# Altium schematic sheet connections.schdoc
size 209 x 297 mm; Scale: 1:1; DocumentType: Схема электрическая принципиальная; FirstReferrence: АБВГ.123456.001; PageSetup: Record=PageOptions|CenterHorizontal=False|CenterVertical=False|PrintScale=0.95|XCorrection=0.00|YCorrection=0.00|PrintKind=1|BorderSize=5000000|LeftOffset=0|BottomOffset=0|Orientation=1|PaperLength=1000|PaperWidth=1000|Scale=100|PaperSource=15|PrintQuality=600|MediaType=1|DitherType=10|PaperKind=A4|PrintScaleMode=1
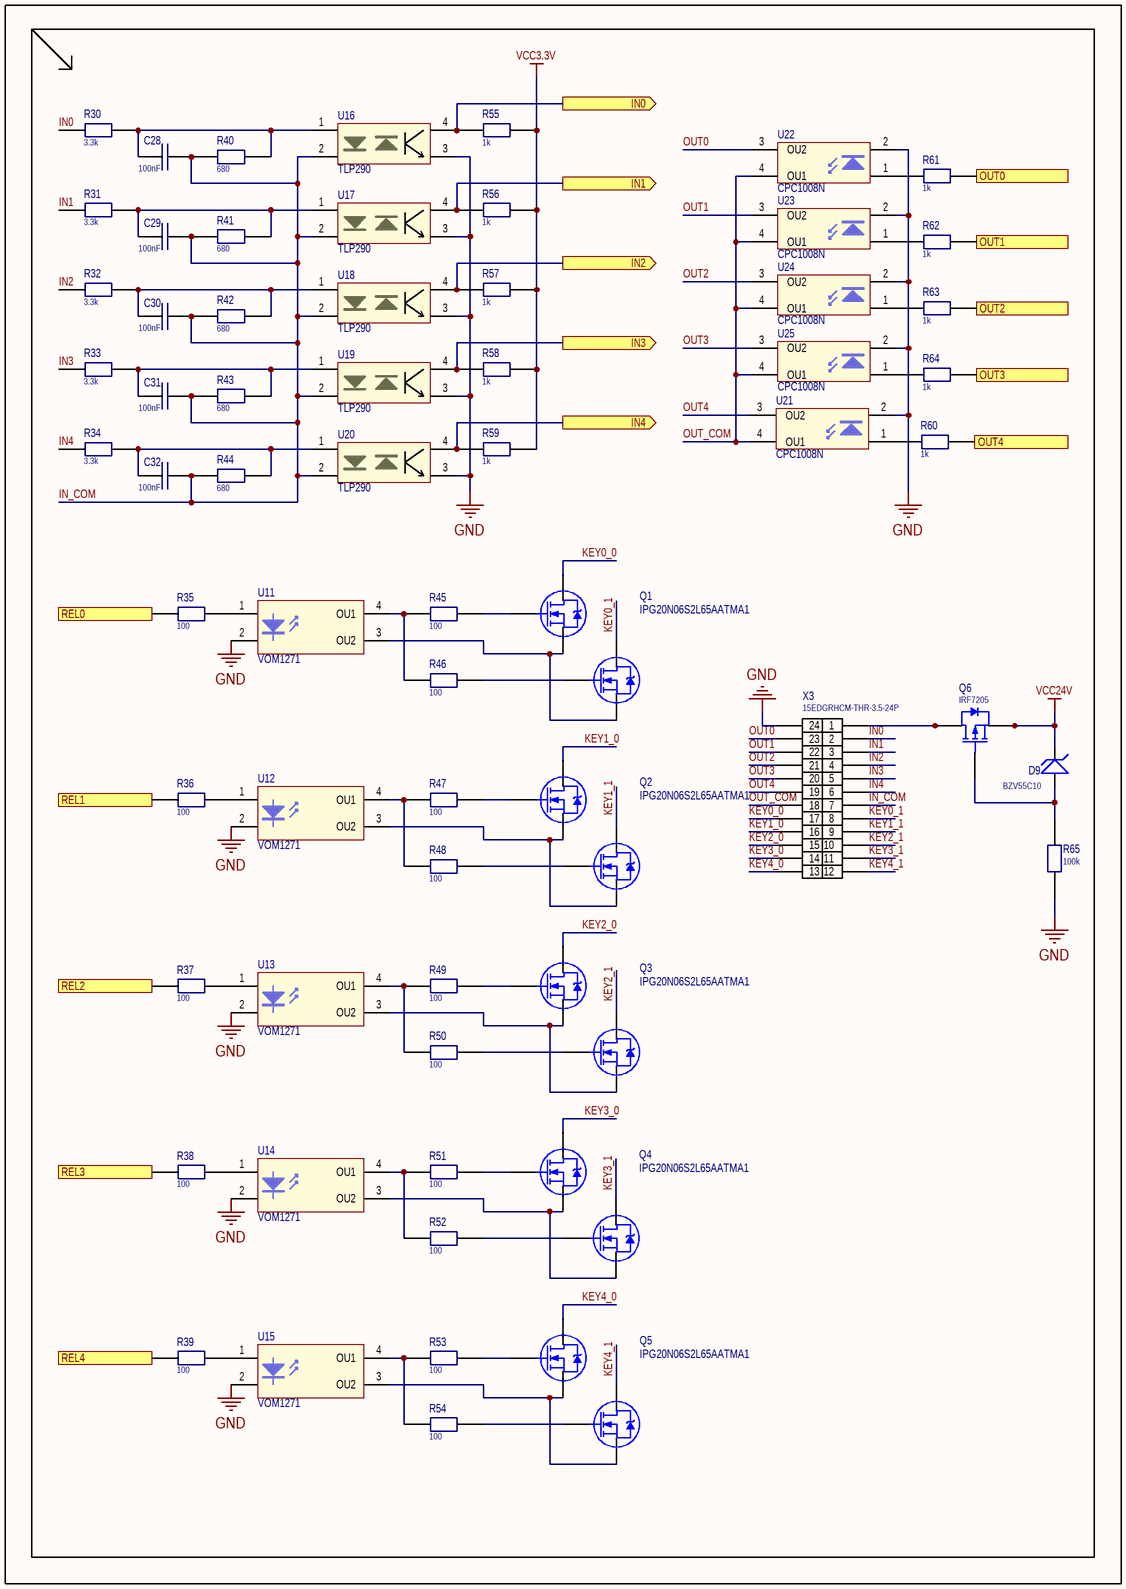
[diagram p0: connections.schdoc]

## Parts
C28  100nF  [C_0603]
C29  100nF  [C_0603]
C30  100nF  [C_0603]
C31  100nF  [C_0603]
C32  100nF  [C_0603]
D9  BZV55C10  [SOD80C]
Q1  IPG20N06S2L65AATMA1  [PowerFlat 5x6]
Q2  IPG20N06S2L65AATMA1  [PowerFlat 5x6]
Q3  IPG20N06S2L65AATMA1  [PowerFlat 5x6]
Q4  IPG20N06S2L65AATMA1  [PowerFlat 5x6]
Q5  IPG20N06S2L65AATMA1  [PowerFlat 5x6]
Q6  IRF7205  [SO-8_M]
R30  3.3k  [R_0805]
R31  3.3k  [R_0805]
R32  3.3k  [R_0805]
R33  3.3k  [R_0805]
R34  3.3k  [R_0805]
R35  100  [R_0603]
R36  100  [R_0603]
R37  100  [R_0603]
R38  100  [R_0603]
R39  100  [R_0603]
R40  680  [R_0603]
R41  680  [R_0603]
R42  680  [R_0603]
R43  680  [R_0603]
R44  680  [R_0603]
R45  100  [R_0603]
R46  100  [R_0603]
R47  100  [R_0603]
R48  100  [R_0603]
R49  100  [R_0603]
R50  100  [R_0603]
R51  100  [R_0603]
R52  100  [R_0603]
R53  100  [R_0603]
R54  100  [R_0603]
R55  1k  [R_0603]
R56  1k  [R_0603]
R57  1k  [R_0603]
R58  1k  [R_0603]
R59  1k  [R_0603]
R60  1k  [R_0603]
R61  1k  [R_0603]
R62  1k  [R_0603]
R63  1k  [R_0603]
R64  1k  [R_0603]
R65  100k  [R_0603]
U11  VOM1271  [SOP-4]
U12  VOM1271  [SOP-4]
U13  VOM1271  [SOP-4]
U14  VOM1271  [SOP-4]
U15  VOM1271  [SOP-4]
U16  TLP290  [SO4_1.27]
U17  TLP290  [SO4_1.27]
U18  TLP290  [SO4_1.27]
U19  TLP290  [SO4_1.27]
U20  TLP290  [SO4_1.27]
U21  CPC1008N  [SO4_2_54]
U22  CPC1008N  [SO4_2_54]
U23  CPC1008N  [SO4_2_54]
U24  CPC1008N  [SO4_2_54]
U25  CPC1008N  [SO4_2_54]
X3  15EDGRHCM-THR-3.5-24P  [DMC 1,5/12-G1F-3,5-LRP20THRR72]

## Ports
IN0 (out), IN1 (out), IN2 (out), IN3 (out), IN4 (out), OUT0 (in), OUT1 (in), OUT2 (in), OUT3 (in), OUT4 (in), REL0 (in), REL1 (in), REL2 (in), REL3 (in), REL4 (in)

## Nets
GND: R65.2 U11.2(K) U12.2(K) U13.2(K) U14.2(K) U15.2(K) U16.3 U17.3 U18.3 U19.3 U20.3 U21.2(K) U22.2(K) U23.2(K) U24.2(K) U25.2(K) X3.24
VCC3.3V: R55.2 R56.2 R57.2 R58.2 R59.2
VCC24V: D9.2(K) Q6.1(S) Q6.2(S) Q6.3(S)
IN0: R30.1 X3.2
IN0: R55.1 U16.4 ; port IN0  [a separate net that carries the same name]
IN1: R31.1 X3.3
IN1: R56.1 U17.4 ; port IN1  [a separate net that carries the same name]
IN2: R32.1 X3.4
IN2: R57.1 U18.4 ; port IN2  [a separate net that carries the same name]
IN3: R33.1 X3.5
IN3: R58.1 U19.4 ; port IN3  [a separate net that carries the same name]
IN4: R34.1 X3.6
IN4: R59.1 U20.4 ; port IN4  [a separate net that carries the same name]
IN_COM: C28.1 C29.1 C30.1 C31.1 C32.1 R40.1 R41.1 R42.1 R43.1 R44.1 U16.2 U17.2 U18.2 U19.2 U20.2 X3.7
KEY0_0: Q1.3(D) X3.17
KEY0_1: Q1.6(D) X3.8
KEY1_0: Q2.3(D) X3.16
KEY1_1: Q2.6(D) X3.9
KEY2_0: Q3.3(D) X3.15
KEY2_1: Q3.6(D) X3.10
KEY3_0: Q4.3(D) X3.14
KEY3_1: Q4.6(D) X3.11
KEY4_0: Q5.3(D) X3.13
KEY4_1: Q5.6(D) X3.12
OUT0: U22.3(OU2) X3.23
OUT0: R61.2 ; port OUT0  [a separate net that carries the same name]
OUT1: U23.3(OU2) X3.22
OUT1: R62.2 ; port OUT1  [a separate net that carries the same name]
OUT2: U24.3(OU2) X3.21
OUT2: R63.2 ; port OUT2  [a separate net that carries the same name]
OUT3: U25.3(OU2) X3.20
OUT3: R64.2 ; port OUT3  [a separate net that carries the same name]
OUT4: U21.3(OU2) X3.19
OUT4: R60.2 ; port OUT4  [a separate net that carries the same name]
OUT_COM: U21.4(OU1) U22.4(OU1) U23.4(OU1) U24.4(OU1) U25.4(OU1) X3.18
REL0: R35.1 ; port REL0
REL1: R36.1 ; port REL1
REL2: R37.1 ; port REL2
REL3: R38.1 ; port REL3
REL4: R39.1 ; port REL4
NetC28_2: C28.2 R30.2 R40.2 U16.1
NetC29_2: C29.2 R31.2 R41.2 U17.1
NetC30_2: C30.2 R32.2 R42.2 U18.1
NetC31_2: C31.2 R33.2 R43.2 U19.1
NetC32_2: C32.2 R34.2 R44.2 U20.1
NetD9_1: D9.1(A) Q6.4(G) R65.1
NetQ1_1: Q1.1(G) R45.2
NetQ1_2: Q1.2(S) Q1.5(S) U11.3(OU2)
NetQ1_4: Q1.4(G) R46.2
NetQ2_1: Q2.1(G) R47.2
NetQ2_2: Q2.2(S) Q2.5(S) U12.3(OU2)
NetQ2_4: Q2.4(G) R48.2
NetQ3_1: Q3.1(G) R49.2
NetQ3_2: Q3.2(S) Q3.5(S) U13.3(OU2)
NetQ3_4: Q3.4(G) R50.2
NetQ4_1: Q4.1(G) R51.2
NetQ4_2: Q4.2(S) Q4.5(S) U14.3(OU2)
NetQ4_4: Q4.4(G) R52.2
NetQ5_1: Q5.1(G) R53.2
NetQ5_2: Q5.2(S) Q5.5(S) U15.3(OU2)
NetQ5_4: Q5.4(G) R54.2
NetQ6_5: Q6.5(D) Q6.6(D) Q6.7(D) Q6.8(D) X3.1
NetR35_2: R35.2 U11.1(A)
NetR36_2: R36.2 U12.1(A)
NetR37_2: R37.2 U13.1(A)
NetR38_2: R38.2 U14.1(A)
NetR39_2: R39.2 U15.1(A)
NetR45_1: R45.1 R46.1 U11.4(OU1)
NetR47_1: R47.1 R48.1 U12.4(OU1)
NetR49_1: R49.1 R50.1 U13.4(OU1)
NetR51_1: R51.1 R52.1 U14.4(OU1)
NetR53_1: R53.1 R54.1 U15.4(OU1)
NetR60_1: R60.1 U21.1(A)
NetR61_1: R61.1 U22.1(A)
NetR62_1: R62.1 U23.1(A)
NetR63_1: R63.1 U24.1(A)
NetR64_1: R64.1 U25.1(A)

## Library data of the parts
C28-C32 = C0603: Capacitor; Part Number: CC0603JPX7R9BB104; Value: 100nF
D9 = DZ_SOD80: Diode; Part Number: BZV55C10
Q1-Q5 = N-ch Dual PowerFLAT 5x6_1: Dual N-ch Mosfet; Part Number: IPG20N06S2L65AATMA1
Q6 = P-ch_SO8: 30V P-Channel  MOSFET; Part Number: IRF7205TRPBF
R30-R34 = RES_SMD: Resistor; Part Number: RC0805FR-073K3L; Alternative Part: *; Value: 3.3k
R35-R39 R45-R54 = RES_SMD: Resistor; Part Number: RC0603FR-07100RL; Alternative Part: *; Value: 100
R40-R44 = RES_SMD: Resistor; Part Number: RC0603FR-07680RL; Alternative Part: *; Value: 680
R55-R64 = RES_SMD: Resistor; Part Number: RC0603FR-071KL; Alternative Part: *; Value: 1k
R65 = RES_SMD: Resistor; Part Number: RC0603FR-07100KL; Alternative Part: *; Value: 100k
U11-U15 = VOM1271: Photovoltaic MOSFET Driver; Part Number: VOM1271T; Alternative Part: *
U16-U20 = TLP290: 4-Pin Phototransistor Optocoupler; Part Number: TLP290[GB.SE; Published: 24-Mar-1999; LatestRevisionDate: 04-Mar-2005; LatestRevisionNote: Sch pins 3 & 4 Swapped.; DatasheetVersion: Nov-2003; PackageReference: SO-4; Publisher: Altium Limited; Alternative Part: *
U21-U25 = OptoMOS_SO4: 4-Pin Phototransistor Optocoupler; Part Number: CPC1008NTR; Published: 24-Mar-1999; LatestRevisionDate: 04-Mar-2005; LatestRevisionNote: Sch pins 3 & 4 Swapped.; DatasheetVersion: Nov-2003; PackageReference: SO-4; Publisher: Altium Limited; Alternative Part: *
X3 = DMC 1,5/12-G1F-3,5-LRP20THRR72 / 1706067: Part Number: 15EDGRHCM-THR-3.5-24P